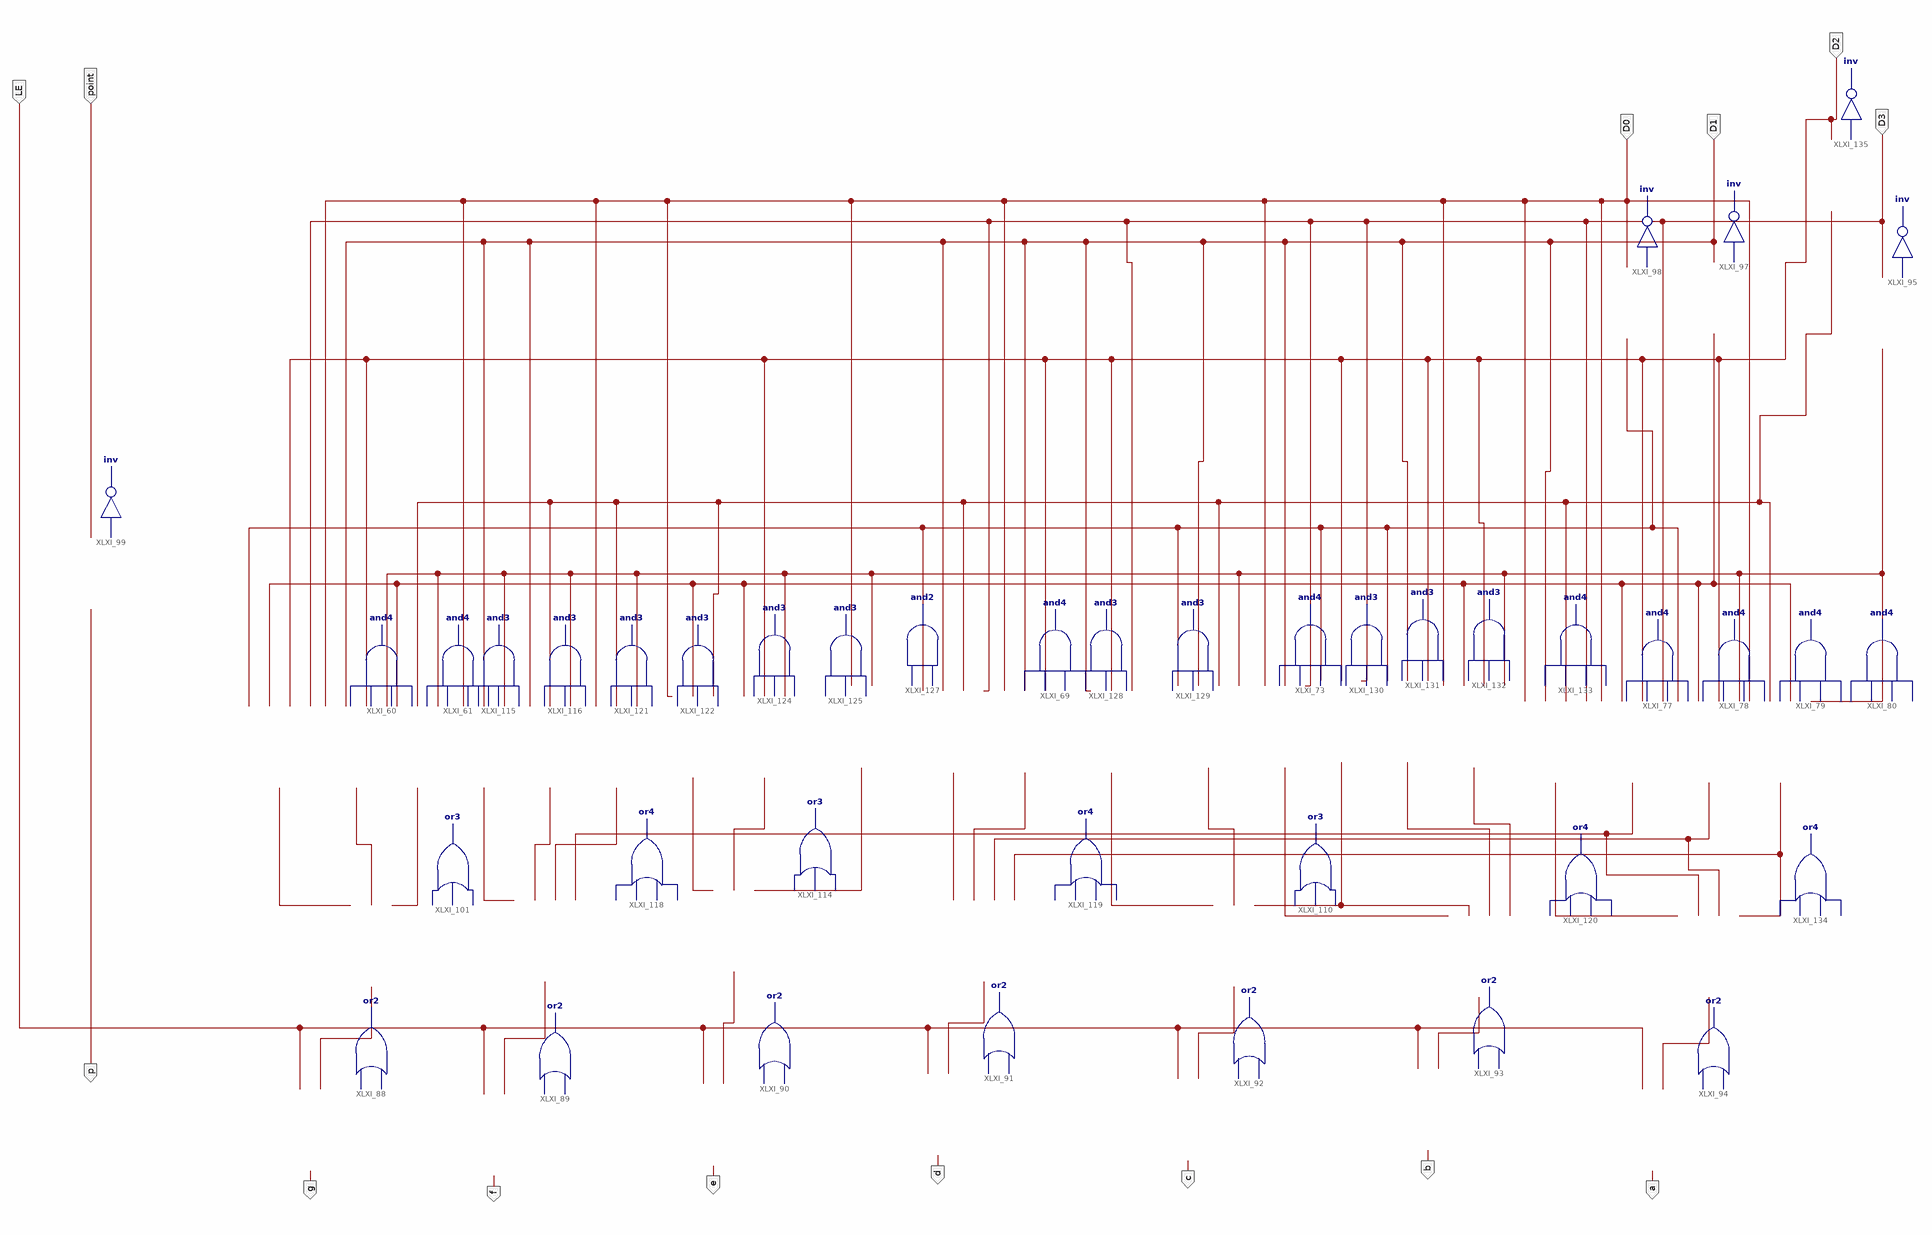
[diagram p0: schematic sheet 1]
// Xilinx ISE schematic MyMC14495.sch (kintex7) as structural Verilog: 40 symbols, 14 ports
module MyMC14495 (
  input  point,
  input  LE,
  input  D0,
  input  D3,
  input  D2,
  input  D1,
  output p,
  output g,
  output f,
  output e,
  output d,
  output c,
  output b,
  output a
);

  wire XLXN_18, XLXN_25, XLXN_29, XLXN_30, XLXN_31, XLXN_32, XLXN_33, XLXN_34, XLXN_54, XLXN_55, XLXN_67,
       XLXN_72, XLXN_73, XLXN_74, XLXN_75, XLXN_76, XLXN_79, XLXN_80, XLXN_82, XLXN_83, XLXN_84, XLXN_85,
       XLXN_86, XLXN_87, XLXN_88, XLXN_89, XLXN_90, XLXN_91, XLXN_92, XLXN_93, XLXN_129, XLXN_130;

  and XLXI_60 (XLXN_33, D3, D2, XLXN_67, XLXN_129);
  and XLXI_61 (XLXN_34, XLXN_55, D2, D1, D0);
  and XLXI_69 (XLXN_83, D3, XLXN_130, D1, XLXN_129);
  and XLXI_73 (XLXN_87, XLXN_55, XLXN_130, D1, XLXN_129);
  and XLXI_77 (XLXN_93, D3, XLXN_130, D1, D0);
  and XLXI_78 (XLXN_76, D3, D2, XLXN_67, D0);
  and XLXI_79 (XLXN_85, XLXN_55, D2, XLXN_67, XLXN_129);
  and XLXI_80 (XLXN_54, XLXN_55, XLXN_67, XLXN_130, D0);
  or XLXI_88 (g, XLXN_18, LE);
  or XLXI_89 (f, XLXN_31, LE);
  or XLXI_90 (e, XLXN_32, LE);
  or XLXI_91 (d, XLXN_30, LE);
  or XLXI_92 (c, XLXN_29, LE);
  or XLXI_93 (b, XLXN_25, LE);
  or XLXI_94 (a, XLXN_92, LE);
  not XLXI_95 (XLXN_55, D3);
  not XLXI_97 (XLXN_67, D1);
  not XLXI_98 (XLXN_129, D0);
  not XLXI_99 (p, point);
  or XLXI_101 (XLXN_18, XLXN_72, XLXN_34, XLXN_33);
  or XLXI_110 (XLXN_29, XLXN_88, XLXN_87, XLXN_86);
  or XLXI_114 (XLXN_32, XLXN_82, XLXN_80, XLXN_79);
  and XLXI_115 (XLXN_72, XLXN_55, XLXN_130, XLXN_67);
  and XLXI_116 (XLXN_73, XLXN_55, D1, D0);
  or XLXI_118 (XLXN_31, XLXN_76, XLXN_75, XLXN_74, XLXN_73);
  or XLXI_119 (XLXN_30, XLXN_54, XLXN_85, XLXN_84, XLXN_83);
  or XLXI_120 (XLXN_25, XLXN_91, XLXN_90, XLXN_88, XLXN_89);
  and XLXI_121 (XLXN_74, XLXN_55, XLXN_130, D1);
  and XLXI_122 (XLXN_75, XLXN_55, XLXN_130, D0);
  and XLXI_124 (XLXN_79, XLXN_130, XLXN_67, D0);
  and XLXI_125 (XLXN_80, XLXN_55, D2, XLXN_67);
  and XLXI_127 (XLXN_82, XLXN_55, D0);
  and XLXI_128 (XLXN_84, D2, D1, D0);
  and XLXI_129 (XLXN_86, D3, D2, D1);
  and XLXI_130 (XLXN_89, D3, D1, D0);
  and XLXI_131 (XLXN_88, D3, D2, XLXN_129);
  and XLXI_132 (XLXN_90, D2, D1, XLXN_129);
  and XLXI_133 (XLXN_91, XLXN_55, D2, XLXN_67, D0);
  or XLXI_134 (XLXN_92, XLXN_54, XLXN_85, XLXN_76, XLXN_93);
  not XLXI_135 (XLXN_130, D2);
endmodule
